# Altium schematic sheet PowerRegulationBoardV2.SchDoc
size A
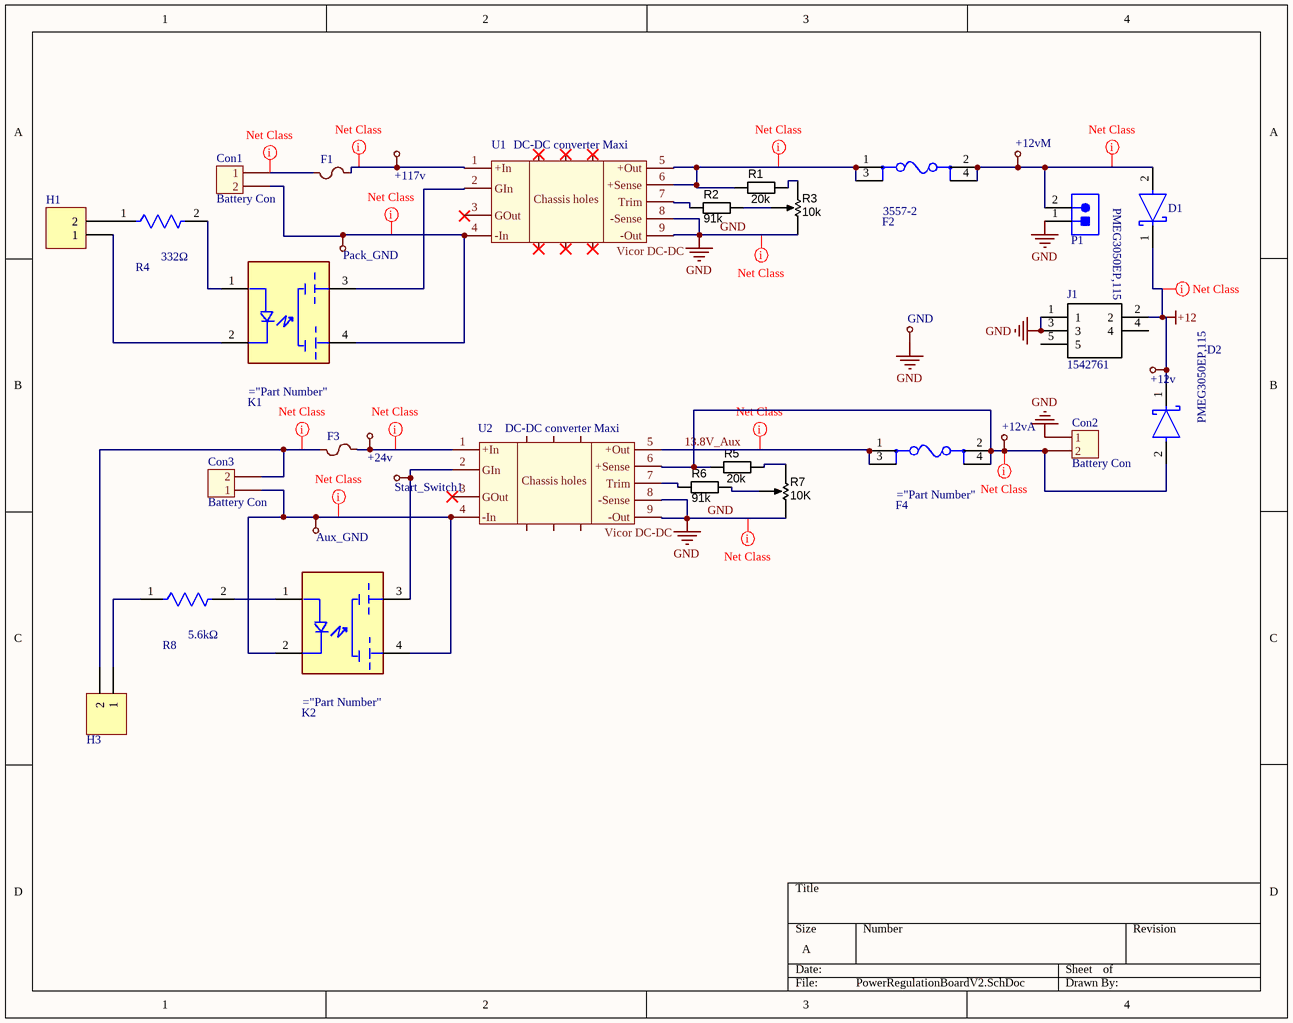
[diagram p0: PowerRegulationBoardV2.SchDoc]

## Parts
+12v  Testpoint  [TestPoint]  (value not drawn)
+12vA  Testpoint  [TestPoint]  (value not drawn)
+12vM  Testpoint  [TestPoint]  (value not drawn)
+24v  Testpoint  [TestPoint]  (value not drawn)
+117v  Testpoint  [TestPoint]  (value not drawn)
Aux_GND  Testpoint  [TestPoint]  (value not drawn)
Con1  Battery Con  [Battery Con]
Con2  Battery Con  [Battery Con]
Con3  Battery Con  [Battery Con]
D1  PMEG3050EP,115  [Nexperia_SOD128_0]  (value not drawn)
D2  PMEG3050EP,115  [Nexperia_SOD128_0]  (value not drawn)
F1  PC TRON Fuse 5A  [PC TRON 5A]  (value not drawn)
F2  3557-2  [Keystone_3557-2_0]  (value not drawn)
F3  PC TRON Fuse 5A  [PC TRON 5A]  (value not drawn)
F4  3557-2  [Keystone_3557-2_0]  (value not drawn)
GND  Testpoint  [TestPoint]  (value not drawn)
H1  Header 0  [HDR1X2]  (value not drawn)
H3  Header 0  [HDR1X2]  (value not drawn)
J1  1542761  [1542761]
K1  CPC1117N  [CPC1117N]  (value not drawn)
K2  CPC1117N  [CPC1117N]  (value not drawn)
P1  SCREW-5.0/5.08 2WAYS  [SCREW-5.0-2WAYS_V]  (value not drawn)
Pack_GND  Testpoint  [TestPoint]  (value not drawn)
R1  value 20k  [Vishay_WSL2010_0]  (hidden comment: Thick Film)
R2  value 91k  [Vishay_WSL2010_0]  (hidden comment: Thick Film)
R3  value 10k  [TrimPot_THT_2.54mm pitch]  (hidden comment: 25 Turn)
R4  RK73H2BTTD3320F  (value not drawn)
R5  value 20k  [Vishay_WSL2010_0]  (hidden comment: Thick Film)
R6  value 91k  [Vishay_WSL2010_0]  (hidden comment: Thick Film)
R7  value 10K  [TrimPot_THT_2.54mm pitch]  (hidden comment: 25 Turn)
R8  CRCW12065K60FKEA  [Vishay_CRCW1206_IPC_A]  (value not drawn)
Start_Switch1  Testpoint  [TestPoint]  (value not drawn)
U1  DC-DC converter Maxi  [Vicor DC-DC Maxi]
U2  DC-DC converter Maxi  [Vicor DC-DC Maxi]

## Nets
+12: +12v.1 D1.1(C) D2.1(C) J1.2
GND: Con2.1 GND.1 J1.1 J1.3 P1.1 R3.1(CW) R7.3(CW) U1.8(-Sense) U1.9(-Out) U2.8(-Sense) U2.9(-Out)
13.8V_Aux: F4.1 F4.3 U2.5(+Out)
Net+12vA_1: +12vA.1 Con2.2 D2.2(A) F4.2 F4.4 R5.2 U2.6(+Sense)
Net+12vM_1: +12vM.1 D1.2(A) F2.2 F2.4 P1.2
Net+24v_1: +24v.1 F3.2 U2.1(+In)
Net+117v_1: +117v.1 F1.2 U1.1(+In)
NetAux_GND_1: Aux_GND.1 Con3.1 K2.2(C) K2.4(DRAIN) U2.4(-In)
NetCon1_1: Con1.1(2) K1.4(DRAIN) Pack_GND.1 U1.4(-In)
NetCon1_2: Con1.2(1) F1.1
NetCon3_2: Con3.2 F3.1 H3.2
NetF2_1: F2.1 F2.3 R1.2 U1.5(+Out) U1.6(+Sense)
NetH1_1: H1.1 K1.2(C)
NetH1_2: H1.2 R4.1
NetH3_1: H3.1 R8.1
NetK1_1: K1.1(A) R4.2
NetK1_3: K1.3(DRAIN) U1.2(GIn)
NetK2_1: K2.1(A) R8.2
NetK2_3: K2.3(DRAIN) Start_Switch1.1 U2.2(GIn)
NetR1_1: R1.1 R3.3(CCW)
NetR2_1: R2.1 R3.2(TAP)
NetR2_2: R2.2 U1.7(Trim)
NetR5_1: R5.1 R7.1(CCW)
NetR6_1: R6.1 R7.2(TAP)
NetR6_2: R6.2 U2.7(Trim)

Not connected (* = marked no-connect by the designer): J1 4 5; U1 3(GOut) 11(10)* 12* 13* 14* 15*; U2 3(GOut)* 11(10) 12 13 14 15

## Layout directives
net class PowerNets: 13.8V_Aux, +12, GND, Net+12vA_1, Net+12vM_1, Net+24v_1, Net+117v_1, NetAux_GND_1, NetCon1_1, NetCon1_2, NetCon3_2, NetF2_1

## Notes on the sheet
- (in symbol DC-DC converter Maxi) Chassis holes; Vicor DC-DC

## Library data of the parts
Con1-Con3 = Battery Con: Aux and Main battery connector
H1 H3 = Header 2: Header, 2-Pin; LatestRevisionDate: 17-Jul-2002; LatestRevisionNote: Re-released for DXP Platform.; Publisher: Altium Limited
J1 = 1542761: Connector; Manufacturer_Name: Phoenix Contact; Allied_Number: 70170366; Datasheet Link: https://media.digikey.com/PDF/Data%20Sheets/Phoenix%20Contact%20PDFs/1542761.pdf; Height: 18mm; Manufacturer_Part_Number: 1542761; Mouser Part Number: 651-1542761; Mouser Price/Stock: https://www.mouser.com/Search/Refine.aspx?Keyword=651-1542761; RS Part Number: 8025583; RS Price/Stock: http://uk.rs-online.com/web/p/products/8025583; Allied Price/Stock: https://www.alliedelec.com/phoenixcontact-1542761/70170366/
P1 = CMP-0617-00009-1: Socket, Screw Terminal Block, 2 Way, 5.0 mm Pitch, 90 Degree Angle, Through-Hole; Manufacturer: No Vendor; Insulation Resistance: 5000 MOhm / 1000 V; Contact Resistance: 20 mOhm; Rated Current: 25 A; Poles: 2; Rated Voltage: 300 V; PartNumber: SCREW-5.0/5.08 2WAYS; ComponentLink1Description: Datasheet; ComponentLink1URL: 5mm screw terminal in SVN; Mounting Technology: Through Hole; PackageDescription: Socket, Screw Terminal Block, 2 Way, Pitch 5 mm, 90 Degree Angle, Through-Hole; Temperature Range: -40 to 105 degC
R1 = RES_10R_2010_5%: RES SMD 20K OHM 1% 3/4W 2010; Manufacturer 1: Vishay/Dale; Manufacturer Part Number 1: CRCW120610R0JNEA; Ratings: 1/4W; SCDType: undef; Tolerance: ±5%; Package / Case: 2010; Supplier 1: Digi-Key; Supplier Part Number 1: 541-10ECT-ND; ComponentLink1URL: http://www.vishay.com/doc?20035; ComponentLink1Description: http://www.vishay.com/doc?20035
R2 R6 = RES_10R_2010_5%: RES SMD 91K OHM 5% 3/4W 2010 / CRCW201091K0JNEF; Manufacturer 1: Vishay/Dale; Manufacturer Part Number 1: CRCW120610R0JNEA; Ratings: 1/4W; SCDType: undef; Package / Case: 2010; Supplier 1: Digi-Key; Supplier Part Number 1: 541-10ECT-ND; ComponentLink1URL: http://www.vishay.com/doc?20035; ComponentLink1Description: http://www.vishay.com/doc?20035; Tolerance: ±5%
R3 R7 = RES_TRIMMER_1K_25T_THT: TRIMMER 10K OHM 0.25W PC PIN TOP / 64WR10KLF; Manufacturer 1: Murata Electronics North America; Manufacturer Part Number 1: PV36Y102C01B00; Tolerance: 10%; Ratings: 25 turn variable cermet; SCDType: spec; Supplier 1: Digi-Key; Supplier Part Number 1: 490-2912-ND
R4 = RK73H2BTTD3320F: Part Number: 332Ω
R5 = RES_10R_2010_5%: RES SMD 20K OHM 1% 3/4W 2010 / CRCW20101K20FKEF; Manufacturer 1: Vishay/Dale; Manufacturer Part Number 1: CRCW120610R0JNEA; Ratings: 1/4W; SCDType: undef; Tolerance: ±5%; Package / Case: 2010; Supplier 1: Digi-Key; Supplier Part Number 1: 541-10ECT-ND; ComponentLink1URL: http://www.vishay.com/doc?20035; ComponentLink1Description: http://www.vishay.com/doc?20035
R8 = CRCW12065K60FKEA: Part Number: 5.6kΩ
D1 D2 = PMEG3050EP,115: Part Number: PMEG3050EP,115
F2 F4 = 3557-2
  F2: Part Number: 3557-2